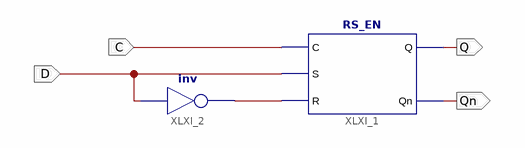
[diagram p0: schematic sheet 1]
// Xilinx ISE schematic D_EN.sch (kintex7) as structural Verilog: 2 symbols, 4 ports
module D_EN (
  input  C,
  input  D,
  output Q,
  output Qn
);

  wire XLXN_5;

  RS_EN XLXI_1 (.C(C), .S(D), .R(XLXN_5), .Q(Q), .Qn(Qn));
  not XLXI_2 (XLXN_5, D);
endmodule
